# EAGLE design ATMega328PCBBoard (EAGLE 7.2.0)
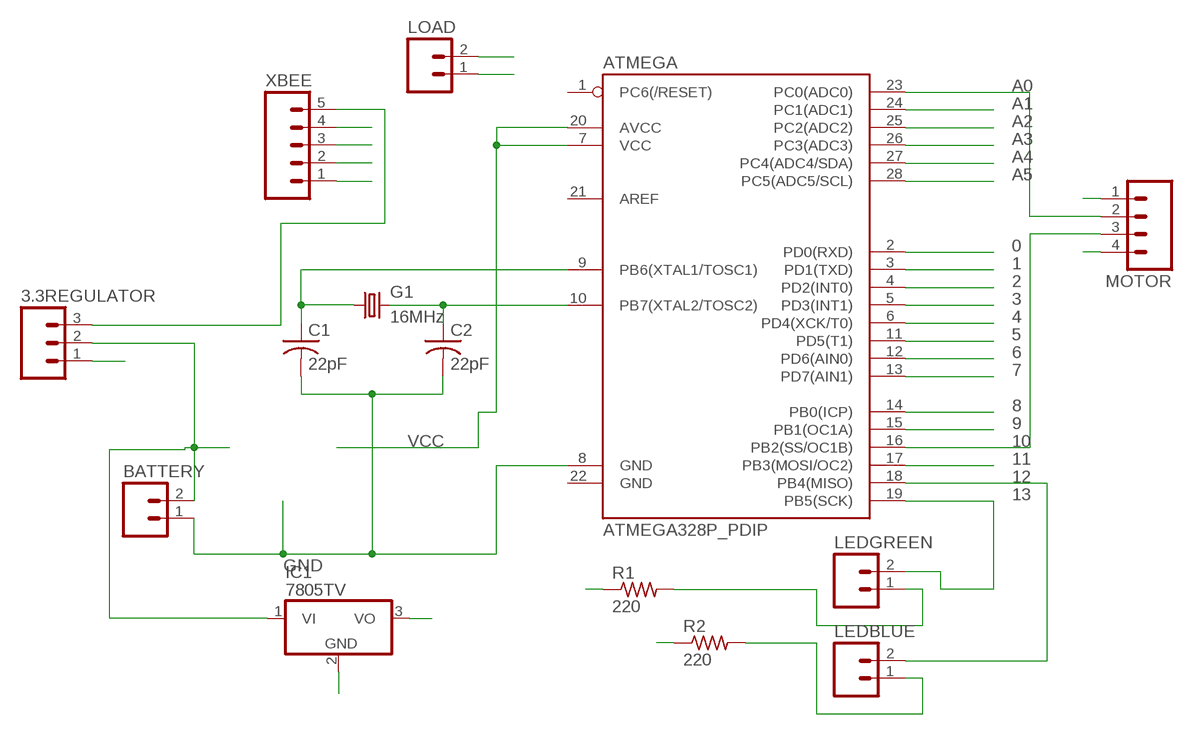
[diagram p0: schematic, sheet 1]

## Parts
3.3REGULATOR  M03JST-PTH-VERT  [JST-3-PTH-VERT]
ATMEGA  ATMEGA328P_PDIP  [DIL28-3]
BATTERY  M02JST-PTH-VERT  [JST-2-PTH-VERT]
C1  22pF  C-US050-025X075  [C050-025X075]
C2  22pF  C-US050-025X075  [C050-025X075]
G1  16MHz  CRYSTALHC49US  [HC49US]
IC1  7805TV  [TO220V]
LEDBLUE  M02JST-PTH-VERT  [JST-2-PTH-VERT]
LEDGREEN  M02JST-PTH-VERT  [JST-2-PTH-VERT]
LOAD  M02JST-PTH-VERT  [JST-2-PTH-VERT]
MOTOR  M04JST  [1X04-1.5MM_JST]
R1  220  R-US_0207/2V  [0207/2V]
R2  220  R-US_0207/2V  [0207/2V]
XBEE  M05JST-VERT  [JST-5-PTH-VERT]

## Nets
0: ATMEGA.2(PD0(RXD)) LOAD.1 XBEE.4
1: ATMEGA.3(PD1(TXD)) LOAD.2 XBEE.3
2: ATMEGA.4(PD2(INT0))
3: ATMEGA.5(PD3(INT1))
3VCC: 3.3REGULATOR.3 XBEE.5
4: ATMEGA.6(PD4(XCK/T0))
5: ATMEGA.11(PD5(T1))
6: ATMEGA.12(PD6(AIN0))
7: ATMEGA.13(PD7(AIN1)) XBEE.1
8: ATMEGA.14(PB0(ICP))
9: ATMEGA.15(PB1(OC1A))
10: ATMEGA.16(PB2(SS/OC1B)) MOTOR.3
11: ATMEGA.17(PB3(MOSI/OC2))
12: ATMEGA.18(PB4(MISO)) LEDBLUE.2
13: ATMEGA.19(PB5(SCK)) LEDGREEN.2
A0: ATMEGA.23(PC0(ADC0)) MOTOR.2
A1: ATMEGA.24(PC1(ADC1))
A2: ATMEGA.25(PC2(ADC2))
A3: ATMEGA.26(PC3(ADC3))
A4: ATMEGA.27(PC4(ADC4/SDA))
A5: ATMEGA.28(PC5(ADC5/SCL))
GND: 3.3REGULATOR.1 ATMEGA.8(GND) BATTERY.1 C1.2 C2.2 IC1.2(GND) MOTOR.4 R1.1 R2.1 XBEE.2
N$1: ATMEGA.10(PB7(XTAL2/TOSC2)) C2.1 G1.2
N$2: ATMEGA.9(PB6(XTAL1/TOSC1)) C1.1 G1.1
N$3: LEDGREEN.1 R1.2
N$4: 3.3REGULATOR.2 BATTERY.2 IC1.1(VI)
N$5: LEDBLUE.1 R2.2
VCC: ATMEGA.7(VCC) ATMEGA.20(AVCC) IC1.3(VO) MOTOR.1
Unconnected: ATMEGA.1(PC6(/RESET)) ATMEGA.21(AREF) ATMEGA.22(GND)

## Notes on the sheet
- A0
- A1
- A2
- A3
- A4
- A5
- 0
- 1
- 2
- 3
- 4
- 5
- 6
- 7
- 8
- 9
- VCC | 10
- 11
- 12
- 13
- GND

## Library data of the parts
3.3REGULATOR = SparkFun-Connectors:M03: Header 3 Standard 3-pin 0.1" header. Use with straight break away headers (SKU : PRT-00116), right angle break away headers (PRT-00553), swiss pins (PRT-00743), machine pins (PRT-00117), and female headers (PRT-00115). Molex polarized connector foot print use with SKU : PRT-08232 with associated crimp pins and housings.
ATMEGA = SparkFun-DigitalIC:ATMEGA328P_PDIP: uC used in the Arduino 32kb flash, 1k EEPROM, 2k SRAM This is the through-hole version of this chip.
BATTERY LEDBLUE LEDGREEN LOAD = SparkFun-Connectors:M02: Standard 2-pin 0.1" header. Use with - straight break away headers ( PRT-00116) - right angle break away headers (PRT-00553) - swiss pins (PRT-00743) - machine pins (PRT-00117) - female headers (PRT-00115) Molex polarized connector foot print use with: PRT-08233 with associated crimp pins and housings. 2.54_SCREWTERM for use with PRT-10571. 3.5mm Screw Terminal footprints for PRT-08084 5mm Screw Terminal footprints for use with PRT-08432
C1 C2 = adafruit:C-US: CAPACITOR, American symbol
G1 = SparkFun-FreqCtrl:CRYSTAL: Various standard crystals. Proven footprints.
IC1 = linear:78*: Positive VOLTAGE REGULATOR Source: http://cache.national.com/ds/LM/LM78L05.pdf http://www.fairchildsemi.com/ds/LM/LM7805.pdf
MOTOR = SparkFun-Connectors:M04: Header 4 Standard 4-pin 0.1" header. Use with straight break away headers (SKU : PRT-00116), right angle break away headers (PRT-00553), swiss pins (PRT-00743), machine pins (PRT-00117), and female headers (PRT-00115). Molex polarized connector foot print use with SKU : PRT-08231 with associated crimp pins and housings. 1MM SMD Version SKU: PRT-10208
R1 R2 = resistor:R-US_: RESISTOR, American symbol
XBEE = SparkFun-Connectors:M05: Header 5 Standard 5-pin 0.1" header. Use with straight break away headers (SKU : PRT-00116), right angle break away headers (PRT-00553), swiss pins (PRT-00743), machine pins (PRT-00117), and female headers (PRT-00115). Molex polarized connector foot print use with SKU : PRT-08230 with associated crimp pins and housings.

## Board
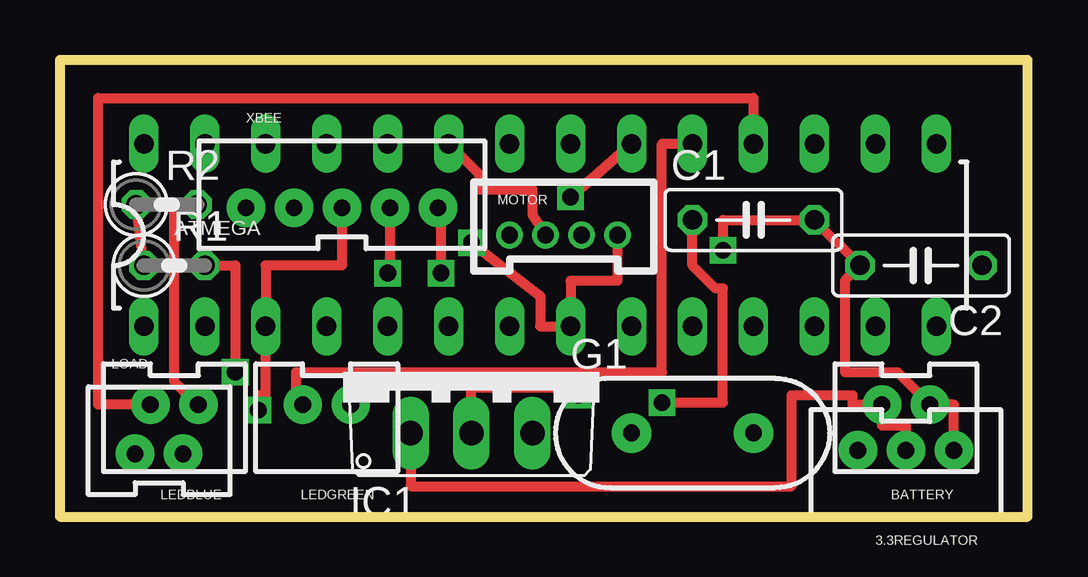
[diagram p1: board, top side]
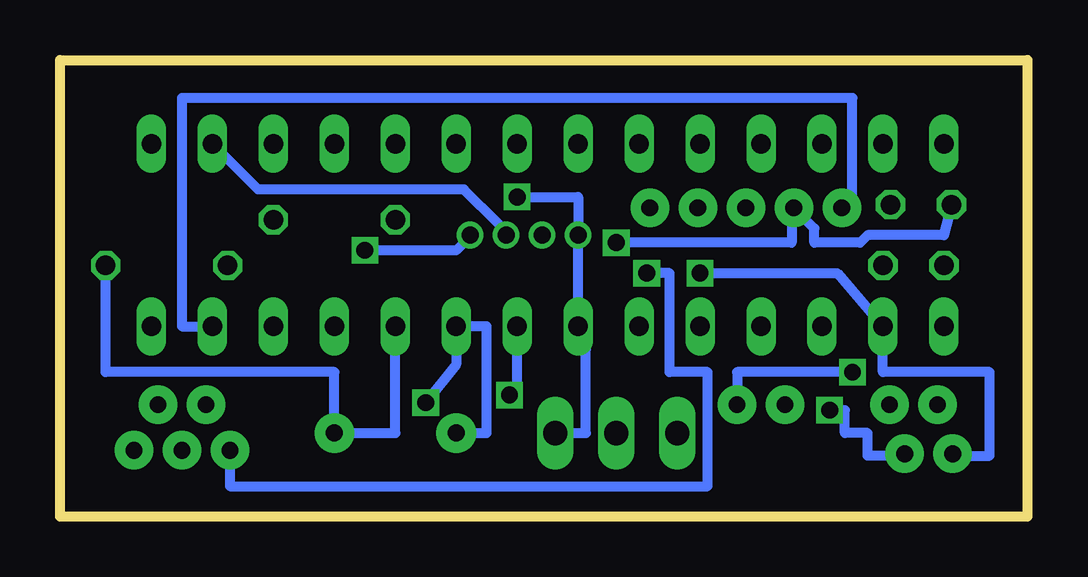
[diagram p2: board, bottom side, seen from below]

Size 40.32 x 19.05 mm. Coordinates in mm from the lower left corner, seen from the top.
Outline: 0,0 40.32,0 40.32,19.05 0,19.05 0,0
Copper layers (1*16): Top 0.0178mm / dielectric 59mil / Bottom 0.0178mm
Design rules "SSC-EAGLE-2Lyr_v1.0.0.3": minimum track width 6mil, minimum drill 14mil, track to track 6mil, track to pad 6mil, pad to pad 6mil, via to via 6mil, smd to smd 6mil, copper to edge 20mil, drill to drill 16mil, minimum pad ring 8mil, minimum via ring 8mil, stop-mask expansion 3mil, vias tented up to drill 0mil, thermal gap 10mil

### Footprints (pad centres in the part's own frame; a part is rotated, then mirrored left to right if it is on the bottom)
JST-3-PTH-VERT = drill 0.7 pad 1.6: 1 -2,-0.55; 2 0,-0.55; 3 2,-0.55
DIL28-3 = drill 0.813 long: 1 -16.51,-3.81; 2 -13.97,-3.81; 3 -11.43,-3.81; 4 -8.89,-3.81; 5 -6.35,-3.81; 6 -3.81,-3.81; 7 -1.27,-3.81; 8 1.27,-3.81; 9 3.81,-3.81; 10 6.35,-3.81; 11 8.89,-3.81; 12 11.43,-3.81; 13 13.97,-3.81; 14 16.51,-3.81; 15 16.51,3.81; 16 13.97,3.81; 17 11.43,3.81; 18 8.89,3.81; 19 6.35,3.81; 20 3.81,3.81; 21 1.27,3.81; 22 -1.27,3.81; 23 -3.81,3.81; 24 -6.35,3.81; 25 -8.89,3.81; 26 -11.43,3.81; 27 -13.97,3.81; 28 -16.51,3.81
JST-2-PTH-VERT = drill 0.7 pad 1.6: 1 -1,-0.55; 2 1,-0.55
C050-025X075 = drill 0.813 octagon: 1 -2.54,0; 2 2.54,0
HC49US = drill 0.7 pad 1.651: 1 -2.54,0; 2 2.54,0
TO220V = drill 1.016 long: 1 -2.54,-2.54; 2 0,-2.54; 3 2.54,-2.54
1X04-1.5MM_JST = drill 0.7: 1 0,0; 2 1.5,0; 3 3,0; 4 4.5,0
0207/2V = drill 0.813 octagon: 1 -1.27,0; 2 1.27,0
JST-5-PTH-VERT = drill 0.7 pad 1.6: 1 -4,0.18; 2 -2,0.18; 3 0,0.18; 4 2,0.18; 5 4,0.18

### Placement (x,y rotation side)
3.3REGULATOR  35.24,2.22 180 top
ATMEGA  20,11.75 0 top
BATTERY  35.24,4.13 180 top
C1  28.89,12.38 0 top
C2  35.88,10.48 180 top
G1  26.35,3.49 0 top
IC1  17.15,6.03 0 top
LEDBLUE  4.76,4.13 180 top
LEDGREEN  11.11,4.13 180 top
LOAD  4.13,3.18 0 top
MOTOR  18.73,11.75 0 top
R1  4.76,10.48 0 top
R2  4.45,13.02 0 top
XBEE  11.75,12.7 0 top

### Tracks (layer width: path | path; a pad name or v marks a point on that pad's centre or on a via)
0  (via drill 0.7)
  Top 0.406: XBEE.4 13.75,10.57 v13.65,10.16
  Bottom 0.406: v13.65,10.16 7.94,10.16 ATMEGA.2 6.03,6.03 1.59,6.03 1.59,2.54 3.13,2.54 LOAD.1
1  (via drill 0.7)
  Top 0.406: XBEE.3 11.75,10.48 8.57,10.48 ATMEGA.3 8.57,5.08 8.26,5.08 v8.26,4.44
  Bottom 0.406: LOAD.2 5.13,2.54 6.67,2.54 6.67,3.49 7.62,3.49 7.62,4.44 v8.26,4.44
3VCC  (via drill 0.7)
  Top 0.406: v15.88,10.16 15.88,12.88 XBEE.5
  Bottom 0.406: 3.3REGULATOR.3 33.24,1.27 13.33,1.27 13.33,6.03 14.92,6.03 14.92,10.16 v15.88,10.16
7
  Bottom 0.406: ATMEGA.13 35.24,7.94 35.24,17.46 7.3,17.46 7.3,13.01 XBEE.1
10
  Bottom 0.406: MOTOR.3 22.05,12.21 23.49,13.65 32.07,13.65 ATMEGA.16
12
  Top 0.406: LEDBLUE.2 1.59,4.68 1.59,17.46 28.89,17.46 ATMEGA.18
13
  Top 0.406: LEDGREEN.2 9.84,4.68 9.84,6.03 25.08,6.03 25.08,15.56 ATMEGA.19
A0
  Top 0.406: ATMEGA.23 17.46,14.29 17.46,13.65 19.68,13.65 19.68,12.61 MOTOR.2
GND  (via drill 0.7)
  Top 0.406: v27.62,11.11 27.62,12.38 C1.2 C2.2 32.7,9.84 32.7,6.03 34.89,6.03 BATTERY.1 37.24,4.68 3.3REGULATOR.1 | v17.15,11.43 20,9.21 20,7.94 ATMEGA.8 21.27,9.84 23.23,9.84 MOTOR.4 | R1.1 R2.1 | IC1.2 17.15,5.4 21.59,5.4 v21.59,5.08
  Bottom 0.406: MOTOR.4 23.23,11.69 23.81,11.11 v27.62,11.11 | v17.15,11.43 9.84,11.43 9.84,12.88 XBEE.2 8.89,12.02 8.89,11.43 6.98,11.43 6.67,11.75 3.49,11.75 R2.1 | v21.59,5.08 21.27,5.08 ATMEGA.8
N$1
  Bottom 0.406: ATMEGA.10 26.35,3.49 G1.2 28.89,6.03 38.42,6.03 C2.1
N$2  (via drill 0.7)
  Top 0.406: v25.08,4.76 27.62,4.76 27.62,9.53 27.3,9.53 26.35,10.48 C1.1
  Bottom 0.406: G1.1 22.54,3.49 22.54,7.94 ATMEGA.9 23.81,6.35 v25.08,4.76
N$3  (via drill 0.7)
  Top 0.406: R1.2 7.3,10.48 v7.3,6.03
  Bottom 0.406: v7.3,6.03 12.11,6.03 LEDGREEN.1
N$4
  Top 0.406: 3.3REGULATOR.2 35.24,3.81 34.24,3.81 BATTERY.2 33.02,4.68 33.02,5.08 30.48,5.08 30.48,1.27 14.6,1.27 IC1.1
N$5
  Top 0.406: LEDBLUE.1 4.76,5.63 4.76,13.02 R2.2
VCC  (via drill 0.7)
  Top 0.406: ATMEGA.20 v21.27,13.33
  Bottom 0.406: v21.27,13.33 18.73,13.33 MOTOR.1 ATMEGA.7 18.73,6.99 18.41,6.99 18.41,3.49 IC1.3